# EAGLE design Adafruit 2.8 inch TFT w Capacitive Touch (EAGLE 6.3)
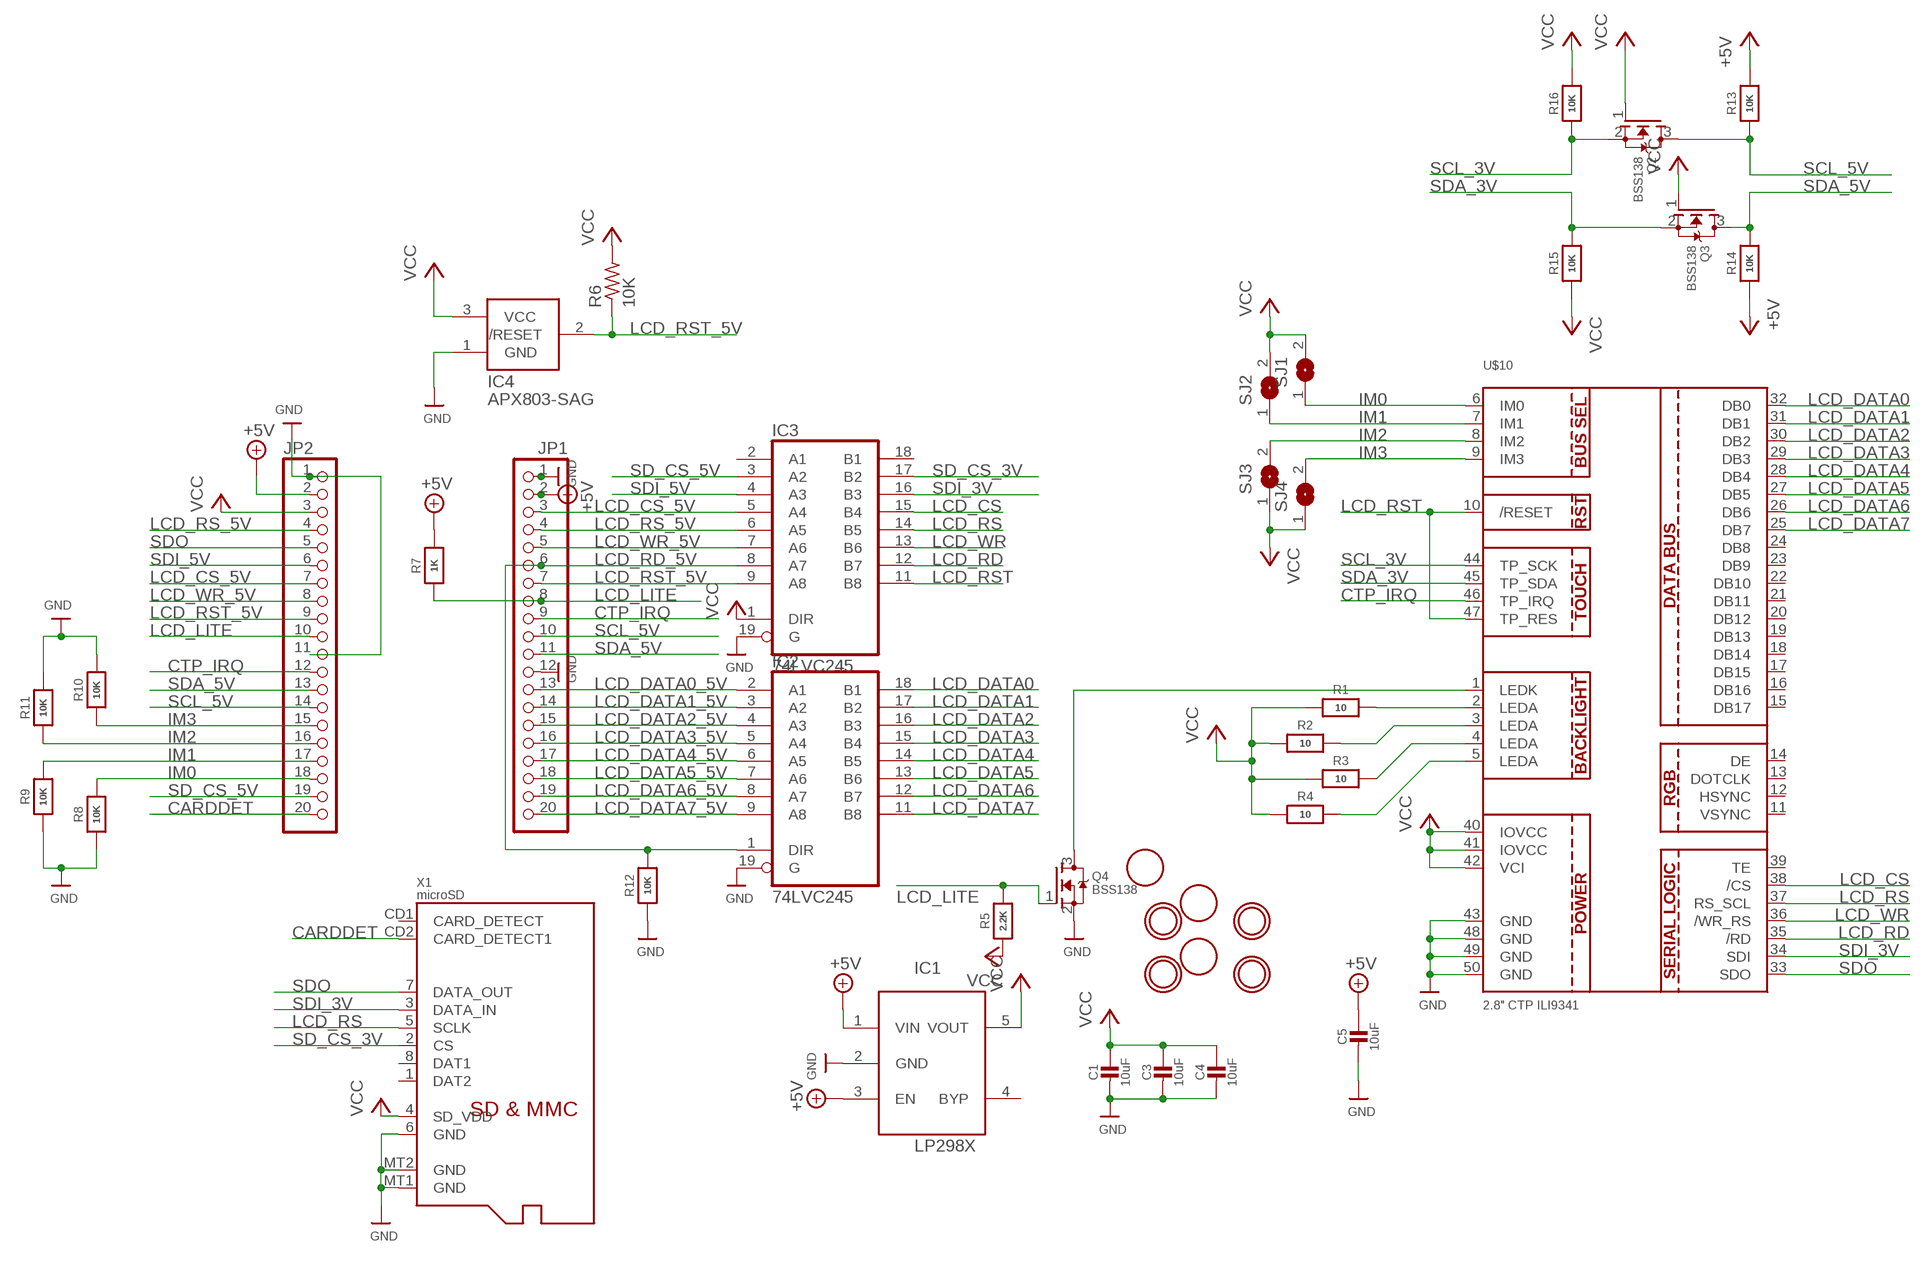
[diagram p0: schematic, sheet 1]

## Parts
C1  10uF  CAP_CERAMIC0805-NOOUTLINE  [0805-NO]
C3  10uF  CAP_CERAMIC0805-NOOUTLINE  [0805-NO]
C4  10uF  CAP_CERAMIC0805-NOOUTLINE  [0805-NO]
C5  10uF  CAP_CERAMIC0805-NOOUTLINE  [0805-NO]
IC1  MIC5225-3.3  LP298XS  [SOT23-5L]
IC2  74LVC245  74ACT245DW  [SO20W]
IC3  74LVC245  74ACT245DW  [SO20W]
IC4  APX803-SAG  AXP083-SAG  [SOT23]
JP1  HEADER-1X20ROUND  [1X20_ROUND]
JP2  HEADER-1X20ROUND  [1X20_ROUND]
Q2  BSS138  MOSFET-NWIDE  [SOT23-WIDE]
Q3  BSS138  MOSFET-NWIDE  [SOT23-WIDE]
Q4  BSS138  MOSFET-NWIDE  [SOT23-WIDE]
R1  10  RESISTOR0805_NOOUTLINE  [0805-NO]
R2  10  RESISTOR0805_NOOUTLINE  [0805-NO]
R3  10  RESISTOR0805_NOOUTLINE  [0805-NO]
R4  10  RESISTOR0805_NOOUTLINE  [0805-NO]
R5  2.2K  RESISTOR0805_NOOUTLINE  [0805-NO]
R6  10K  R-US_R0805  [R0805]
R7  1K  RESISTOR0805_NOOUTLINE  [0805-NO]
R8  10K  RESISTOR0805_NOOUTLINE  [0805-NO]
R9  10K  RESISTOR0805_NOOUTLINE  [0805-NO]
R10  10K  RESISTOR0805_NOOUTLINE  [0805-NO]
R11  10K  RESISTOR0805_NOOUTLINE  [0805-NO]
R12  10K  RESISTOR0805_NOOUTLINE  [0805-NO]
R13  10K  RESISTOR0805_NOOUTLINE  [0805-NO]
R14  10K  RESISTOR0805_NOOUTLINE  [0805-NO]
R15  10K  RESISTOR0805_NOOUTLINE  [0805-NO]
R16  10K  RESISTOR0805_NOOUTLINE  [0805-NO]
SJ1  SOLDERJUMPER  [SOLDERJUMPER_ARROW_NOPASTE]
SJ2  SOLDERJUMPER  [SOLDERJUMPER_ARROW_NOPASTE]
SJ3  SOLDERJUMPER  [SOLDERJUMPER_ARROW_NOPASTE]
SJ4  SOLDERJUMPER  [SOLDERJUMPER_ARROW_NOPASTE]
U$7  MOUNTINGHOLE3.0THIN  [MOUNTINGHOLE_3.0_PLATEDTHIN]
U$9  FIDUCIAL  [FIDUCIAL_1MM]
U$10  2.8" CTP ILI9341  DISP_LCD_CTP28_SAMPLE  [TFT_2.83IN_240X320_50PIN]
U$11  FIDUCIAL  [FIDUCIAL_1MM]
U$15  MOUNTINGHOLE3.0THIN  [MOUNTINGHOLE_3.0_PLATEDTHIN]
U$16  MOUNTINGHOLE3.0THIN  [MOUNTINGHOLE_3.0_PLATEDTHIN]
U$17  MOUNTINGHOLE3.0THIN  [MOUNTINGHOLE_3.0_PLATEDTHIN]
U$23  FIDUCIAL  [FIDUCIAL_1MM]
X1  microSD  MICROSD  [MICROSD]

## Nets
+5V: C5.1 IC1.1(VIN) IC1.3(EN) JP1.2 JP2.2 R7.2 R13.2 R14.1
CARDDET: JP2.20 X1.CD2(CARD_DETECT1)
CTP_IRQ: JP1.9 JP2.12 U$10.46(TP_IRQ)
GND: C1.2 C3.2 C4.2 C5.2 IC1.2(GND) IC2.19(G) IC3.19(G) IC4.1(GND) JP1.1 JP1.12 JP2.1 JP2.11 Q4.2(S) R8.1 R9.1 R10.2 R11.2 R12.1 U$10.43(GND) U$10.48(GND) U$10.49(GND) U$10.50(GND) X1.6(GND) X1.MT1(GND) X1.MT2(GND)
IM0: JP2.18 R8.2 SJ1.1 U$10.6(IM0)
IM1: JP2.17 R9.2 SJ2.1 U$10.7(IM1)
IM2: JP2.16 R11.1 SJ3.2 U$10.8(IM2)
IM3: JP2.15 R10.1 SJ4.2 U$10.9(IM3)
LCD_CS: IC3.15(B4) U$10.38(/CS)
LCD_CS_5V: IC3.5(A4) JP1.3 JP2.7
LCD_DATA0: IC2.18(B1) U$10.32(DB0)
LCD_DATA0_5V: IC2.2(A1) JP1.13
LCD_DATA1: IC2.17(B2) U$10.31(DB1)
LCD_DATA1_5V: IC2.3(A2) JP1.14
LCD_DATA2: IC2.16(B3) U$10.30(DB2)
LCD_DATA2_5V: IC2.4(A3) JP1.15
LCD_DATA3: IC2.15(B4) U$10.29(DB3)
LCD_DATA3_5V: IC2.5(A4) JP1.16
LCD_DATA4: IC2.14(B5) U$10.28(DB4)
LCD_DATA4_5V: IC2.6(A5) JP1.17
LCD_DATA5: IC2.13(B6) U$10.27(DB5)
LCD_DATA5_5V: IC2.7(A6) JP1.18
LCD_DATA6: IC2.12(B7) U$10.26(DB6)
LCD_DATA6_5V: IC2.8(A7) JP1.19
LCD_DATA7: IC2.11(B8) U$10.25(DB7)
LCD_DATA7_5V: IC2.9(A8) JP1.20
LCD_LITE: JP1.8 JP2.10 Q4.1(G) R5.2 R7.1
LCD_RD: IC3.12(B7) U$10.35(/RD)
LCD_RD_5V: IC2.1(DIR) IC3.8(A7) JP1.6 R12.2
LCD_RS: IC3.14(B5) U$10.37(RS_SCL) X1.5(SCLK)
LCD_RS_5V: IC3.6(A5) JP1.4 JP2.4
LCD_RST: IC3.11(B8) U$10.10(/RESET) U$10.47(TP_RES)
LCD_RST_5V: IC3.9(A8) IC4.2(/RESET) JP1.7 JP2.9 R6.1
LCD_WR: IC3.13(B6) U$10.36(/WR_RS)
LCD_WR_5V: IC3.7(A6) JP1.5 JP2.8
N$1: R4.2 U$10.5(LEDA)
N$2: R1.2 U$10.2(LEDA)
N$3: R2.2 U$10.3(LEDA)
N$4: R3.2 U$10.4(LEDA)
N$5: Q4.3(D) U$10.1(LEDK)
SCL_3V: Q2.2(S) R16.1 U$10.44(TP_SCK)
SCL_5V: JP1.10 JP2.14 Q2.3(D) R13.1
SD_CS_3V: IC3.17(B2) X1.2(CS)
SD_CS_5V: IC3.3(A2) JP2.19
SDA_3V: Q3.2(S) R15.2 U$10.45(TP_SDA)
SDA_5V: JP1.11 JP2.13 Q3.3(D) R14.2
SDI_3V: IC3.16(B3) U$10.34(SDI) X1.3(DATA_IN)
SDI_5V: IC3.4(A3) JP2.6
SDO: JP2.5 U$10.33(SDO) X1.7(DATA_OUT)
VCC: C1.1 C3.1 C4.1 IC1.5(VOUT) IC3.1(DIR) IC4.3(VCC) JP2.3 Q2.1(G) Q3.1(G) R1.1 R2.1 R3.1 R4.1 R5.1 R6.2 R15.1 R16.2 SJ1.2 SJ2.2 SJ3.1 SJ4.1 U$10.40(IOVCC) U$10.41(IOVCC) U$10.42(VCI) X1.4(SD_VDD)
Unconnected: IC1.4(BYP) IC3.2(A1) IC3.18(B1) U$10.11(VSYNC) U$10.12(HSYNC) U$10.13(DOTCLK) U$10.14(DE) U$10.15(DB17) U$10.16(DB16) U$10.17(DB15) U$10.18(DB14) U$10.19(DB13) U$10.20(DB12) U$10.21(DB11) U$10.22(DB10) U$10.23(DB9) U$10.24(DB8) U$10.39(TE) X1.1(DAT2) X1.8(DAT1) X1.CD1(CARD_DETECT)

## Power pins joined to a net without a drawn wire
GND: IC2.10(GND) IC3.10(GND)
VCC: IC2.20(VCC) IC3.20(VCC)

## Library data of the parts
C1 C3-C5 = microbuilder:CAP_CERAMIC: Ceramic Capacitors For new designs, use the packages preceded by an '_' character since they are more reliable: The following footprints should be used on most boards: _0402 - Standard footprint for regular board layouts _0603 - Standard footprint for regular board layouts _0805 - Standard footprint for regular board layouts _1206 - Standard footprint for regular board layouts For extremely tight-pitch boards where space is at a premium, the following 'micro-pitch' footprints can be used (smaller pads, no silkscreen outline, etc.): _0402MP - Micro-pitch footprint for very dense/compact boards _0603MP - Micro-pitch footprint for very dense/compact boards _0805MP - Micro-pitch footprint for very dense/compact boards _1206MP - Micro-pitch footprint for very dense/compact boards
IC1 = adafruit:LP298X
IC2 IC3 = 74xx-eu:74*245: Octal BUS TRANSCEIVER, 3-state
IC4 = adafruit:AXP083
JP1 JP2 = microbuilder:HEADER-1X20
Q2-Q4 = microbuilder:MOSFET-N: N-Channel Mosfet LEGEND VDS: Voltage Drain-Source ID: Drain Current RDS(ON): Drain-Source On-State Resistance VGS(TH): Gate-Source Threshold Voltage CISS: Drain-Source Input Capacitance SOT-23 Name VDS ID RDS(ON) VGS(TH) CISS Order Number 2N7002E 60V 260mA 2.5 Ohm 2.5V @ 250uA 26.7pF @ 25V 2N7002ET1GOSTR-ND BSH103 30V 850mA 400 mOhm 400mV @ 1mA 83pF @ 24V BSH103,235-ND BSS138 60V 320mA 1.6 Ohm 1.5V @ 250uA 50pF @ 10V Mouser: 771-BSS138PW115 DMN2075U-7 20V 4.2A 38 mOhm 1V @ 250 uA 594.3pF @ 10V DMN2075U-7DICT-ND * BSS138 good choice for I2C level-shifting POWERPAK 1212-8 Name VDS ID RDS(ON) VGS(TH) CISS Order Number Si7308DN 60V 6A 58 mOhm 3V @ 250uA 665pF @ 15V SI7308DN-T1-E3CT-ND
R1-R5 R7-R16 = microbuilder:RESISTOR: Resistors For new designs, use the packages preceded by an '_' character since they are more reliable: The following footprints should be used on most boards: _0402 - Standard footprint for regular board layouts _0603 - Standard footprint for regular board layouts _0805 - Standard footprint for regular board layouts _1206 - Standard footprint for regular board layouts For extremely tight-pitch boards where space is at a premium, the following 'micro-pitch' footprints can be used (smaller pads, no silkscreen outline, etc.): _0402MP - Micro-pitch footprint for very dense/compact boards _0603MP - Micro-pitch footprint for very dense/compact boards _0805MP - Micro-pitch footprint for very dense/compact boards _1206MP - Micro-pitch footprint for very dense/compact boards
R6 = rcl:R-US_: RESISTOR, American symbol
SJ1-SJ4 = microbuilder:SOLDERJUMPER: SMD Solder JUMPER Solder the two pads together to create a connection, or remove the solder to break it. REFLOW - Use this footprint for solder paste and reflow ovens. WAVE - Use this footprint for hand-soldering (larger pads). CLOSED - Has a trace between the two pads to ensure it is closed by default. The trace needs to be cut to disable the jumper, and can be closed again by creating a solder bridge between the two pads.; BOM: EXCLUDE
U$7 U$15-U$17 = microbuilder:MOUNTINGHOLE: Mounting Hole For #2 screws (0.086"/2.18mm width, 0.094"/2.4mm hole) use 2.5mm; BOM: EXCLUDE
U$9 U$11 U$23 = adafruit:FIDUCIAL: For use by pick and place machines to calibrate the vision/machine, 1mm By microbuilder.eu
U$10 = microbuilder:DISP_LCD_CTP28: 2.83" 240x320 Pixel Capacitive Touch Display
X1 = microbuilder:MICROSD: MicroSD/Transflash Card Holder with SPI pinout 3M: 2908-05WB-MG 4UConnector: 19656 Footprint courtesy: Adafruit Industries

## Board
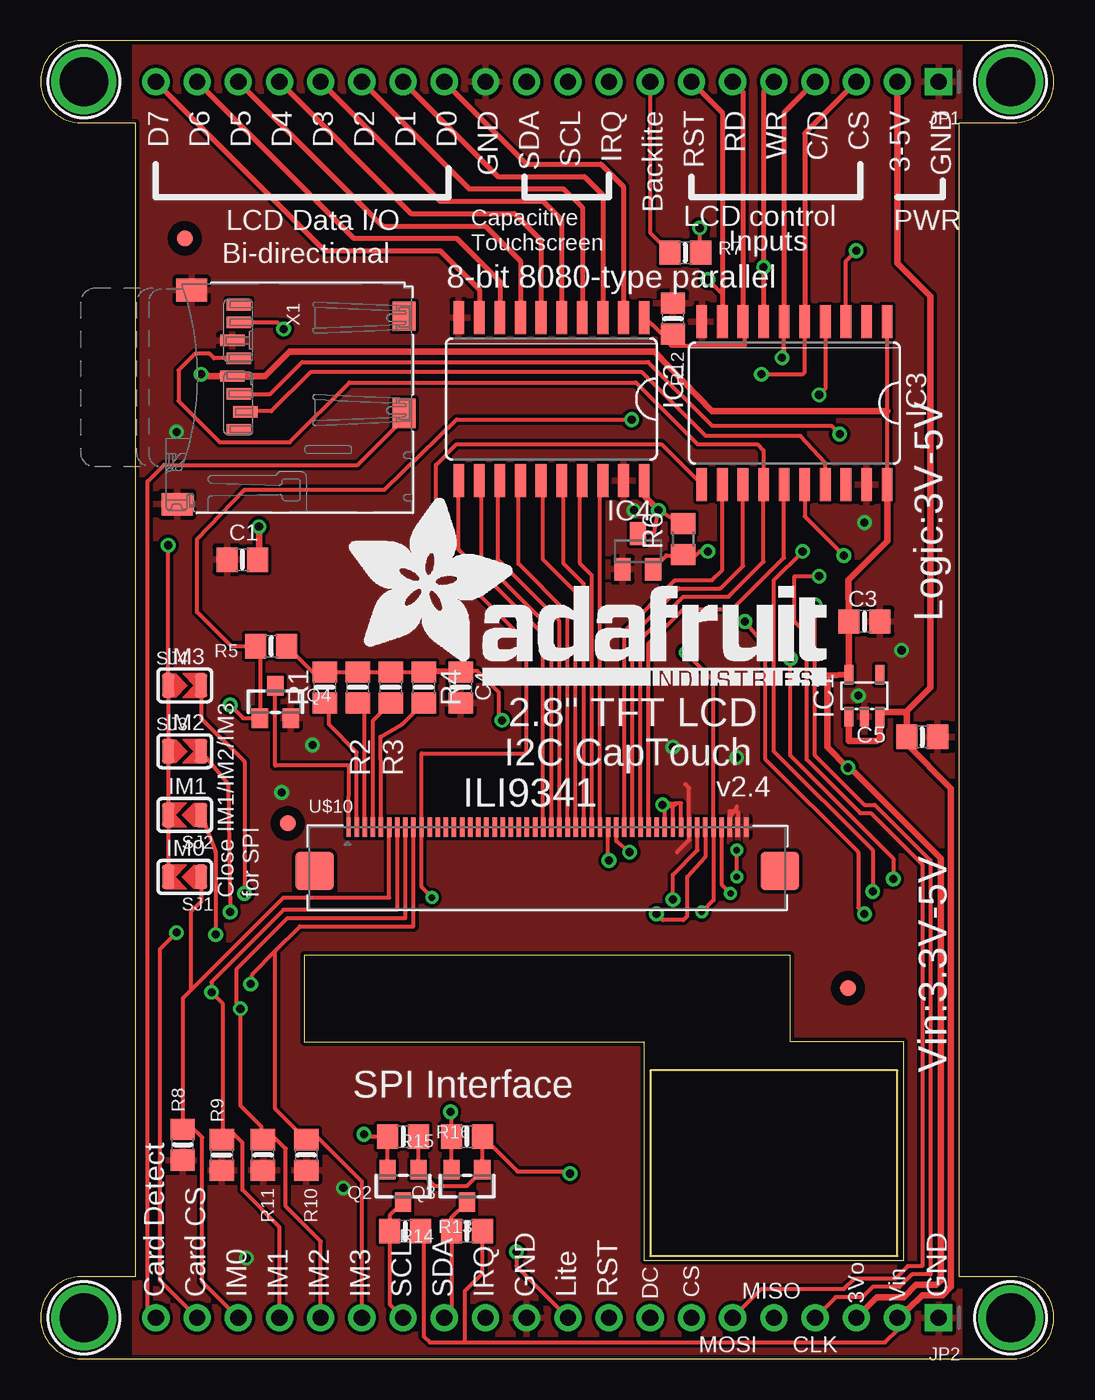
[diagram p1: board, top side]
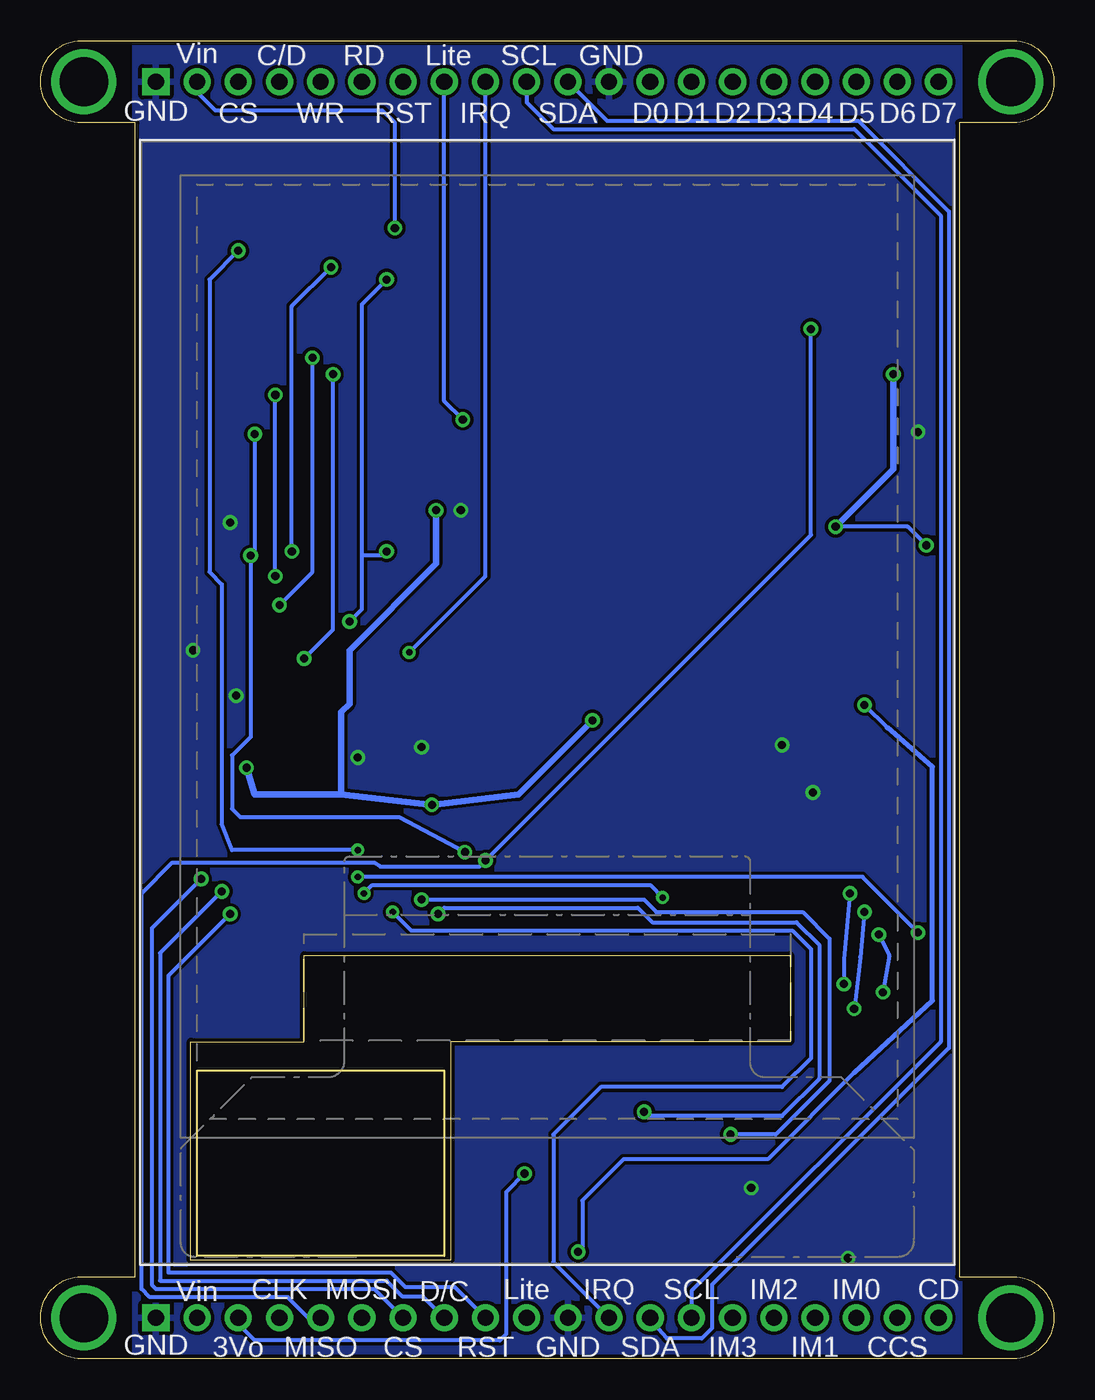
[diagram p2: board, bottom side, seen from below]

Size 62.48 x 81.28 mm. Coordinates in mm from the lower left corner, seen from the top.
Outline: 0,2.54 arc90 2.54,0 59.94,0 arc90 62.48,2.54 arc90 59.94,5.08 56.64,5.08 56.64,76.2 59.94,76.2 arc90 62.48,78.74 arc90 59.94,81.28 2.54,81.28 arc90 0,78.74 arc90 2.54,76.2 5.84,76.2 5.84,5.08 2.54,5.08 arc90 0,2.54
Outline: 16.26,24.89 16.26,19.56 37.21,19.56 37.21,6.1 53.21,6.1 53.21,19.56 46.23,19.56 46.23,24.89 16.26,24.89
Copper layers (1*16): Top 0.035mm / dielectric 1.5mm / Bottom 0.035mm
Design rules "adafruit": minimum track width 8mil, minimum drill 15.5mil, track to track 8mil, track to pad 8mil, pad to pad 8mil, via to via 8mil, smd to smd 8mil, copper to edge 10mil, drill to drill 8mil, minimum pad ring 10mil, minimum via ring 8mil, stop-mask expansion 4mil, vias tented up to drill 20mil, thermal gap 10mil
tRestrict: area 42.7,32.6 to 42.8,32.9; area 43.2,32.6 to 43.3,32.9

### Footprints (pad centres in the part's own frame; a part is rotated, then mirrored left to right if it is on the bottom)
0805-NO = smd 1.3 x 1.5: 1 -0.95,0; 2 0.95,0
SOT23-5L = smd 0.55 x 1.2: 1 -0.95,-1.3; 2 0,-1.3; 3 0.95,-1.3; 4 0.95,1.3; 5 -0.95,1.3
SO20W = smd 0.66 x 2.032: 1 -5.715,-5.029; 2 -4.445,-5.029; 3 -3.175,-5.029; 4 -1.905,-5.029; 5 -0.635,-5.029; 6 0.635,-5.029; 7 1.905,-5.029; 8 3.175,-5.029; 9 4.445,-5.029; 10 5.715,-5.029; 11 5.715,5.029; 12 4.445,5.029; 13 3.175,5.029; 14 1.905,5.029; 15 0.635,5.029; 16 -0.635,5.029; 17 -1.905,5.029; 18 -3.175,5.029; 19 -4.445,5.029; 20 -5.715,5.029
SOT23 = smd 1 x 1.4: 1 -0.95,-1.1; 2 0.95,-1.1; 3 0,1.1
1X20_ROUND = drill 1 pad 1.676 square: 1 -24.13,0 | drill 1 pad 1.676: 2 -21.59,0; 3 -19.05,0; 4 -16.51,0; 5 -13.97,0; 6 -11.43,0; 7 -8.89,0; 8 -6.35,0; 9 -3.81,0; 10 -1.27,0; 11 1.27,0; 12 3.81,0; 13 6.35,0; 14 8.89,0; 15 11.43,0; 16 13.97,0; 17 16.51,0; 18 19.05,0; 19 21.59,0; 20 24.13,0
SOT23-WIDE = smd 1 x 1.2: 1 -0.95,-1; 2 0.95,-1; 3 0,1
R0805 = smd 1.3 x 1.5: 1 -0.95,0; 2 0.95,0
SOLDERJUMPER_ARROW_NOPASTE = smd 0.762 x 1.524: 1 -1.016,0; 2 1.016,0
MOUNTINGHOLE_3.0_PLATEDTHIN = drill 3 pad 3.6: P$1 0,0
FIDUCIAL_1MM = smd 1 x 1: 1 0,0
TFT_2.83IN_240X320_50PIN = smd 0.275 x 1.2 bottom: 1 12.25,-10.39; 2 11.75,-10.39; 3 11.25,-10.39; 4 10.75,-10.39; 5 10.25,-10.39; 6 9.75,-10.39; 7 9.25,-10.39; 8 8.75,-10.39; 9 8.25,-10.39; 10 7.75,-10.39; 11 7.25,-10.39; 12 6.75,-10.39; 13 6.25,-10.39; 14 5.75,-10.39; 15 5.25,-10.39; 16 4.75,-10.39; 17 4.25,-10.39; 18 3.75,-10.39; 19 3.25,-10.39; 20 2.75,-10.39; 21 2.25,-10.39; 22 1.75,-10.39; 23 1.25,-10.39; 24 0.75,-10.39; 25 0.25,-10.39; 26 -0.25,-10.39; 27 -0.75,-10.39; 28 -1.25,-10.39; 29 -1.75,-10.39; 30 -2.25,-10.39; 31 -2.75,-10.39; 32 -3.25,-10.39; 33 -3.75,-10.39; 34 -4.25,-10.39; 35 -4.75,-10.39; 36 -5.25,-10.39; 37 -5.75,-10.39; 38 -6.25,-10.39; 39 -6.75,-10.39; 40 -7.25,-10.39; 41 -7.75,-10.39; 42 -8.25,-10.39; 43 -8.75,-10.39; 44 -9.25,-10.39; 45 -9.75,-10.39; 46 -10.25,-10.39; 47 -10.75,-10.39; 48 -11.25,-10.39; 49 -11.75,-10.39; 50 -12.25,-10.39 | smd 2.4 x 2.4 bottom: PAD1 14.35,-13.09; PAD2 -14.35,-13.09
MICROSD = smd 0.7 x 1.5: 1 9,-10.64; 2 7.9,-10.24; 3 6.8,-10.64; 4 5.7,-11.04; 5 4.6,-10.64; 6 3.5,-11.04; 7 2.4,-10.64; 8 1.3,-10.64 | smd 1.8 x 1.4: CD1 2,-0.44; CD2 8,-0.44 | smd 1.4 x 1.9: MT1 0.4,-13.54; MT2 13.6,-14.44

### Placement (x,y rotation side)
C1  12.45,49.28 180 top
C3  50.8,45.47 0 top
C4  25.91,41.4 270 top
C5  54.36,38.35 0 top
IC1  50.8,40.89 0 top
IC2  31.5,59.18 180 top
IC3  46.48,58.93 180 top
IC4  36.83,49.78 0 top
JP1  31.24,78.74 180 top
JP2  31.24,2.54 180 top
Q2  22.35,10.67 180 top
Q3  26.29,10.67 180 top
Q4  14.48,40.51 0 top
R1  17.53,41.4 270 top
R2  19.56,41.4 270 top
R3  21.59,41.4 270 top
R4  23.62,41.4 270 top
R5  14.22,43.94 180 top
R6  39.62,50.55 90 top
R7  39.75,68.2 0 top
R8  8.76,13.21 90 top
R9  11.18,12.57 90 top
R10  16.38,12.57 270 top
R11  13.72,12.57 270 top
R12  38.99,64.14 270 top
R13  22.48,7.87 0 top
R14  26.29,7.87 180 top
R15  26.29,13.72 180 top
R16  22.35,13.72 0 top
SJ1  8.89,29.72 180 top
SJ2  8.89,33.53 180 top
SJ3  8.89,37.47 0 top
SJ4  8.89,41.53 0 top
U$7  2.67,2.54 0 top
U$9  49.78,22.86 0 top
U$10  31.24,43.18 0 bottom
U$11  8.89,69.09 0 top
U$15  59.82,2.54 0 top
U$16  2.67,78.74 0 top
U$17  59.82,78.74 0 top
U$19  [ADAFRUIT_TEXT_30MM]  18.8,41.53 0 top
U$23  15.24,33.02 0 top
X1  22.86,66.29 270 top

### Tracks (layer width: path | path; a pad name or v marks a point on that pad's centre or on a via)
+5V  (via drill 0.5)
  Top 0.254: R7.2 40.64,68.26 v40.64,69.72 | R13.2 23.62,7.68 23.62,1.4 24,1.02 26.04,1.02 | 26.04,1.02 26.16,1.14 26.16,4.19 27.24,5.27 R14.1 | 26.04,1.02 52.07,1.02 52.96,1.91 52.96,2.41 JP2.2
  Top 0.406: JP1.2 52.83,67.56 54.86,65.53 54.86,41.4 53.34,39.88 | 53.34,39.88 52.03,39.88 IC1.3 51.75,38.29 51.56,38.1 49.85,38.1 IC1.1 | 52.85,2.56 JP2.2 52.96,2.67 52.96,3.05 53.47,3.05 54.36,3.94 55.63,3.94 56.13,4.45 56.13,35.18 53.41,37.91 C5.1 53.41,39.88 53.34,39.88
  Bottom 0.254: v40.64,69.72 40.64,76.2 41.4,76.96 51.69,76.96 52.83,78.11 JP1.2
CARDDET
  Top 0.254: JP2.20 6.6,3.05 6.6,54.1 7.62,55.12 19.56,55.12 22.42,57.98 X1.CD2
CTP_IRQ  (via drill 0.39)
  Top 0.254: v40.77,27.56 41.49,28.28 U$10.46 41.49,41.82 v39.75,43.56
  Bottom 0.254: 27.56,2.41 JP2.12 30.86,5.97 30.86,13.84 27.94,16.76 16.76,16.76 14.99,18.54 14.99,25.27 16.13,26.42 39.62,26.42 v40.77,27.56 | v39.75,43.56 35.05,48.26 JP1.9
GND  (via drill 0.5)
  Top 0.254: 42.93,34.04 42.55,33.42 U$10.48 42.49,33.78 42.93,33.78 42.99,33.72 U$10.49 | 39.24,31.24 39.99,31.99 U$10.43 39.99,35.19 39.75,35.43
  other vias: 36.58,52.32 50.8,51.56 38.99,37.72 42.93,37.08 50.42,40.89 53.09,43.69 14.86,34.92 8.38,57.15 18.67,10.54 12.7,6.22 16.76,37.85
  pour Top: 5.84,81.28 5.84,0 56.64,0 56.64,81.28
  pour Bottom: 5.84,81.03 5.84,-0.25 56.64,-0.25 56.64,81.03
IM0
  Top 0.254: 9.27,22.73 14.99,28.45 21.49,28.45 U$10.6 | JP2.18 9.97,4.77 9.97,13.66 9.27,14.35 8.96,14.22 R8.2 8.76,22.23 8.95,22.42 9.27,22.73 | SJ1.1 9.91,28.19 9.27,27.56 9.27,22.73
IM1  (via drill 0.5)
  Top 0.254: U$10.7 21.99,27.69 14.99,27.69 10.54,23.24 v10.54,22.61 11.23,21.92 11.23,14.03 | JP2.17 14.73,8.13 12.45,10.41 12.45,13.34 11.75,14.03 11.23,14.03 | 11.23,14.03 R9.2 | SJ2.1 10.8,31.24 v10.8,26.16
  Bottom 0.254: v10.8,26.16 10.16,24.89 v10.54,22.61
IM2  (via drill 0.5)
  Top 0.254: U$10.8 22.49,27.18 15.24,27.18 12.07,24 12.07,21.84 v12.32,21.59 12.32,15.62 13.59,14.35 13.59,13.65 R11.1 13.66,13.59 14.48,13.59 15.11,12.95 15.11,9.4 17.27,7.24 JP2.16 | SJ3.2 11.56,35.43 v11.68,27.56
  Bottom 0.254: v11.68,27.56 11.94,24.77 v12.32,21.59
IM3  (via drill 0.5)
  Top 0.254: U$10.9 22.99,26.67 16,26.67 14.48,25.15 | JP2.15 19.81,10.92 17.02,13.72 16.58,13.72 R10.1 14.48,15.43 14.48,25.15 | 9.91,41.91 SJ4.2 9.91,39.5 12.57,36.83 v12.57,28.7 | v12.95,23.11 13.08,23.75 14.48,25.15
  Bottom 0.254: v12.57,28.7 12.95,24.64 v12.95,23.11
LCD_CS
  Top 0.254: U$10.38 37.49,44.1 39.62,46.23 42.67,46.23 45.85,49.4 IC3.15 45.97,53.77
LCD_CS_5V  (via drill 0.5)
  Top 0.254: v46.23,43.18 46.23,37.21 52.58,30.86 v52.58,29.59 | v44.45,60.71 46.99,60.71 47.12,60.83 IC3.5
  Top 0.305: JP1.3 47.12,75.56 IC3.5
  Bottom 0.254: v46.23,43.18 44.45,44.96 v44.45,60.71 | v52.58,29.59 55.63,26.54 55.63,4.57 55.37,4.32 41.91,4.32 JP2.7
LCD_DATA0
  Top 0.254: U$10.32 34.49,53.97 IC2.18
LCD_DATA0_5V
  Top 0.305: JP1.13 29.97,73.66 34.54,73.66 35.94,72.26 IC2.2
LCD_DATA1
  Top 0.254: U$10.31 33.99,48.3 33.27,49.02 33.27,54.03 IC2.17
LCD_DATA1_5V
  Top 0.305: JP1.14 28.19,72.9 33.53,72.9 34.67,71.75 IC2.3
LCD_DATA2
  Top 0.254: U$10.30 33.49,47.79 32.26,49.02 32.26,54.03 IC2.16
LCD_DATA2_5V
  Top 0.305: JP1.15 26.42,72.14 32.26,72.14 33.4,70.99 IC2.4
LCD_DATA3
  Top 0.254: U$10.29 32.99,47.27 30.99,49.28 30.99,54.03 IC2.15
LCD_DATA3_5V
  Top 0.305: JP1.16 24.64,71.37 30.99,71.37 32.13,70.23 IC2.5
LCD_DATA4
  Top 0.254: U$10.28 32.49,45.99 29.46,49.02 29.46,54.03 IC2.14
LCD_DATA4_5V
  Top 0.305: JP1.17 22.86,70.61 29.21,70.61 30.86,68.96 IC2.6
LCD_DATA5
  Top 0.254: U$10.27 31.99,45.48 28.19,49.28 28.19,54.03 IC2.13
LCD_DATA5_5V
  Top 0.305: JP1.18 21.08,69.85 27.43,69.85 29.59,67.69 IC2.7
LCD_DATA6
  Top 0.254: U$10.26 31.49,44.96 27.18,49.28 27.18,54.03 IC2.12
LCD_DATA6_5V
  Top 0.305: JP1.19 19.3,69.09 25.65,69.09 28.32,66.42 IC2.8
LCD_DATA7
  Top 0.254: U$10.25 30.99,44.7 25.78,49.91 IC2.11
LCD_DATA7_5V
  Top 0.305: JP1.20 17.53,68.33 24.64,68.33 27.05,65.91 IC2.9
LCD_LITE  (via drill 0.5)
  Top 0.254: v36.45,57.91 25.65,57.91 21.21,53.59 12.57,53.59 9.65,50.55 9.65,46.04 11.75,43.94 R5.2 13.53,43.69 Q4.1 12.49,39.51 v11.68,40.32 | R7.1 37.59,69.41 JP1.8 | v29.34,6.6 29.34,5.72 JP2.10
  Bottom 0.254: v36.45,57.91 37.59,59.05 JP1.8 | v11.68,40.32 10.29,38.92 | 12.32,17.65 17.65,12.32 26.54,12.32 29.08,9.78 29.08,6.86 v29.34,6.6
  Bottom 0.305: 12.32,17.65 7.49,22.1 7.49,36.51 10.29,38.92
LCD_RD
  Top 0.254: U$10.35 35.99,44.88 39.12,48.01 41.4,48.01 42.04,48.64 IC3.12 41.91,53.77
LCD_RD_5V
  Top 0.254: IC2.1 37.72,63.75 38.61,62.87 38.86,62.48 | 38.86,62.48 43.43,62.48 43.43,63.83 IC3.8 | R12.2 38.99,63.5 38.86,63.37 38.86,62.48
  Top 0.305: JP1.6 43.31,78.11 IC3.8
LCD_RS
  Top 0.254: U$10.37 36.99,44.36 39.62,46.99 42.42,46.99 44.58,49.15 IC3.14 | 44.45,53.77 IC3.14 | X1.5 10.7,61.69 10.41,61.98 9.53,61.98 8.51,60.96 8.51,59.05 11.05,56.52 15.37,56.52 19.05,60.2 36.7,60.2 40.51,56.39 44.2,56.39 44.58,56.01 IC3.14
LCD_RS_5V  (via drill 0.5)
  Top 0.254: v47.75,46.48 47.75,37.21 50.8,34.16 51.44,34.16 54.86,30.73 54.86,5.21 53.72,5.21 52.96,4.45 51.31,4.45 50.67,3.81 49.02,3.81 JP2.4 | v45.72,61.72 45.85,62.1 45.85,62.23 | 45.85,62.23 IC3.6 | 45.59,61.98 45.85,62.23
  Top 0.305: JP1.4 45.85,76.84 IC3.6
  Bottom 0.254: v47.75,46.48 45.72,48.51 v45.72,61.72
LCD_RST  (via drill 0.39)
  Top 0.254: IC3.11 38.28,56.39 25.65,56.39 24.38,55.12 24.38,49.78 29.97,44.2 29.97,37.34 23.49,37.34 U$10.10 23.49,29.09 v24.13,28.45 | U$10.47 41.99,29.26 v42.55,28.7
  Bottom 0.254: v42.55,28.7 42.04,29.21 24.89,29.21 v24.13,28.45
LCD_RST_5V  (via drill 0.5)
  Top 0.254: v43.43,45.47 44.7,43.94 44.7,36.96 50.42,31.24 50.42,27.81 v50.8,27.43 | v41.15,66.55 42.04,65.66 IC3.9 | IC4.2 38.59,49.53 40.39,49.53 | 40.39,49.53 40.2,49.85 R6.1 | 40.39,49.53 40.64,49.78 v41.15,49.78
  Top 0.305: JP1.7 42.04,76.84 IC3.9
  Bottom 0.254: v43.43,45.47 42.67,46.23 42.67,49.53 | 42.67,49.53 42.67,65.02 v41.15,66.55 | v41.15,49.78 41.4,49.53 42.67,49.53 | v50.8,27.43 54.61,23.62 54.61,5.33 40.89,5.33 40.01,4.45 36.96,4.45 JP2.9
LCD_WR
  Top 0.254: U$10.36 36.49,44.62 39.37,47.5 41.91,47.5 43.31,48.9 IC3.13 43.43,53.77
LCD_WR_5V  (via drill 0.5)
  Top 0.254: v46.99,49.78 45.21,48.01 45.21,37.47 51.31,31.37 v51.31,28.83 | 44.7,63.83 IC3.7
  Top 0.305: JP1.5 44.58,78.11 v44.58,67.31 IC3.7
  Bottom 0.254: v46.99,49.78 46.99,64.9 v44.58,67.31 | v51.31,28.83 55.12,25.02 55.12,4.83 41.15,4.83 40.2,3.87 38.93,3.87 JP2.8
N$1
  Top 0.254: U$10.5 20.99,35.47 20.95,38.35 22.29,39.12 R4.2
N$2
  Top 0.254: U$10.2 19.49,37.4 17.78,39.12 17.78,40.2 R1.2
N$3
  Top 0.254: U$10.3 19.99,40.02 R2.2
N$4
  Top 0.254: U$10.4 20.49,39.35 R3.2
N$5
  Top 0.254: U$10.1 19.03,36.6 14.48,36.58 Q4.3
SCL_3V  (via drill 0.5)
  Top 0.254: Q2.2 R16.1 | R16.1 21.4,14.29 | v38.99,28.32 38.99,29.84 40.51,31.37 40.51,32.88 U$10.44 | v19.94,13.84 20.07,13.72 R16.1
  Bottom 0.254: v38.99,28.32 25.27,28.32 24.51,27.56 15.49,27.56 13.84,25.91 13.84,17.14 17.15,13.84 v19.94,13.84
SCL_5V
  Top 0.254: JP2.14 21.53,3.36 R13.1 21.53,8.84 Q2.3
  Bottom 0.254: JP1.10 32.51,77.47 30.86,75.82 12.32,75.82 6.98,70.48 6.98,19.56 22.35,4.19 JP2.14
SD_CS_3V
  Top 0.254: IC3.17 48.39,55.25 46.86,56.9 41.02,56.9 37.08,60.83 16.64,60.83 14.22,58.42 12.65,58.42 X1.2
SD_CS_5V  (via drill 0.39, 0.5)
  Top 0.254: IC3.3 49.66,67.69 v50.29,68.33 | JP2.19 7.37,4.83 7.37,25.27 v8.38,26.29 | v42.93,29.72 v42.93,31.37
  Bottom 0.254: v50.29,68.33 52.07,66.55 52.07,48.51 51.31,47.75 51.31,33.02 50.67,31.37 v42.93,31.37 | v42.93,29.72 11.81,29.72 v8.38,26.29
SDA_3V  (via drill 0.5)
  Top 0.254: U$10.45 40.99,30.96 39.88,29.72 39.88,27.3 39.62,27.05 38.35,27.05 v37.97,27.43 | Q3.2 R15.2 25.34,14.8 v25.27,15.24
  Bottom 0.254: v37.97,27.43 37.59,27.81 25.65,27.81 24.77,26.92 15.88,26.92 14.48,25.53 14.48,17.27 16.76,14.99 25.53,14.99 v25.27,15.24
SDA_5V
  Top 0.254: Q3.3 25.34,8.72 R14.2 25.34,2.99 JP2.13
  Bottom 0.254: JP1.11 27.56,76.33 12.07,76.33 6.48,70.74 6.48,19.18 21.08,4.57 21.08,1.91 21.72,1.27 23.88,1.27 24.89,2.41 JP2.13
SDI_3V  (via drill 0.5)
  Top 0.254: IC3.16 47.12,51.94 v49.53,49.53 | v36.32,31.24 35.49,31.95 U$10.34 | X1.3 14.16,59.49 16.13,61.47 37.47,61.47 41.4,57.53 48.77,57.53 v49.28,57.02
  Bottom 0.254: v36.32,31.24 40.39,33.4 50.16,33.4 50.67,33.91 50.67,37.21 49.53,38.35 v49.53,49.53 49.28,49.78 v49.28,57.02
SDI_5V  (via drill 0.5)
  Top 0.254: JP2.6 44.45,4.32 49.53,4.32 50.16,4.95 52.7,4.95 53.47,5.72 54.36,5.72 54.36,30.48 51.18,33.66 50.55,33.66 47.24,36.96 47.24,44.7 46.48,45.47 46.48,48.26 v48.01,48.26 | IC3.4 48.39,59.82 v48.01,59.44
  Bottom 0.254: v48.01,48.26 v48.01,59.44
SDO  (via drill 0.5)
  Top 0.254: v35.05,30.73 34.99,30.79 U$10.33 | v14.99,63.5 14.59,63.89 X1.7
  Bottom 0.254: v14.99,63.5 14.99,50.8 v35.05,30.73 35.43,30.35 41.53,30.35 41.91,30.61 54.36,30.61 56.26,28.7 56.26,4.32 55.75,3.81 47.24,3.81 45.97,2.54 JP2.5
VCC  (via drill 0.5)
  Top 0.254: R4.1 R3.1 R2.1 18.03,42.35 R1.1 16.76,42.35 R5.1 | IC3.20 52.2,58.42 IC3.1 | R6.2 39.05,51.75 v38.1,52.32 37.85,50.97 IC4.3 | SJ2.2 SJ3.1 SJ4.1 v7.87,50.16 | 7.87,33.02 SJ2.2 | SJ2.2 SJ1.2 | R16.2 Q2.1 24.3,10.67 26.29,10.67 27.24,11.62 Q3.1 R15.1 29.4,11.56 32.51,11.56 v32.64,11.43 | 28.26,39.56 28.26,41.08 26.92,42.42 25.97,42.42 C4.1 | U$10.40 38.49,34.16 v38.35,34.16 39.12,34.16 39.12,34.25 39.49,34.25 U$10.42 | U$10.41 38.99,34.16
  Top 0.406: IC3.20 52.2,50.42 49.8,48.02 C3.1 IC1.5 48.51,42.13 48.51,37.72 v49.78,36.45 49.8,36.45 49.8,36.56 55.5,30.86 55.5,4.83 55.25,4.57 53.98,4.57 53.21,3.81 51.56,3.81 JP2.3 | R4.1 24.13,42.35 24.18,42.4 C4.1 | 28.26,39.56 v28.45,39.37 | v38.35,34.16 38.99,34.16 | 52.2,58.42 41.4,58.42 37.85,62.1 15.37,62.1 13.86,60.59 X1.4 10.02,60.59 v9.91,60.71 | IC2.20 37.21,53.21 v38.1,52.32 | C1.1 13.46,49.29 v13.46,51.31
  Bottom 0.254: v7.87,50.16 9.02,51.31 v13.46,51.31 | v32.64,11.43 33.78,10.29 33.78,1.52 34.16,1.14 49.28,1.14 50.29,2.16 JP2.3
  Bottom 0.406: v28.45,39.37 33.02,34.8 v38.35,34.16 43.94,34.8 | 43.94,34.8 49.28,34.8 v49.78,36.45 | 43.94,34.8 43.94,39.88 43.43,40.39 43.43,43.69 38.1,49.02 v38.1,52.32 | v13.46,51.31 9.91,54.86 v9.91,60.71

### Text on the board
tPlace: D7 | D6 | D5 | D4 | D3 | D2 | D1 | D0 | GND | SDA | SCL | IRQ | Backlite | RST | RD | WR | C/D | CS | 3-5V | GND | LCD Data I/O | LCD control | PWR | Capacitive / Touchscreen | Inputs | Bi-directional | 8-bit 8080-type parallel | Logic:3V-5V | IM3 | IM2 | 2.8" TFT LCD | I2C CapTouch | IM1 | v2.4 | ILI9341 | IM0 | Close IM1/IM2/IM3 / for SPI | SPI Interface | Vin:3.3V-5V | MISO | Card Detect | Card CS | IM0 | IM1 | IM2 | IM3 | SCL | SDA | IRQ | GND | Lite | RST | DC | CS | 3Vo | Vin | GND | MOSI | CLK
bPlace: GND | SCL | Lite | RD | C/D | Vin | D7 | D6 | D5 | D4 | D3 | D2 | D1 | D0 | SDA | IRQ | RST | WR | CS | GND | CD | IM0 | IM2 | SCL | IRQ | Lite | D/C | MOSI | CLK | Vin | CCS | IM1 | IM3 | SDA | GND | RST | CS | MISO | 3Vo | GND